# EAGLE design FilterSupplySingle (EAGLE 6.6.0)
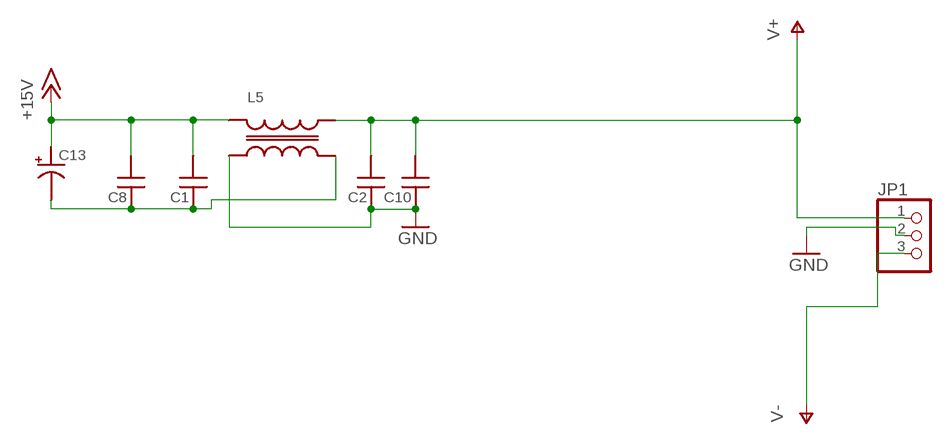
[diagram p0: schematic, sheet 1]

## Parts
C1  C_MLCC_SMDCMLCC_0805  [C_MLCC_0805]
C2  C_MLCC_SMDCMLCC_0805  [C_MLCC_0805]
C8  C_MLCC_SMDCMLCC_0603  [C_MLCC_0603]
C10  C_MLCC_SMDCMLCC_0603  [C_MLCC_0603]
C13  C_POL_SMDF  [PANASONIC_F]
JP1  PINHD-1X3  [1X03]
L5  MSD7342  [MSD7342]

## Nets
+15V: C1.P$2 C8.P$2 C13.+ L5.2
GND: C2.P$1 C10.P$1 JP1.2 L5.1
N$2: C1.P$1 C8.P$1 C13.- L5.3
V+: C2.P$2 C10.P$2 JP1.1 L5.4
V-: JP1.3

## Library data of the parts
C1 C2 C8 C10 = jqi_passives:C_MLCC_SMD
C13 = jqi_passives:C_POL_SMD
JP1 = pinhead:PINHD-1X3: PIN HEADER
L5 = coilcraft-jqi:MSD7342: MSD1260 series 1:1 coupled inductors

## Board
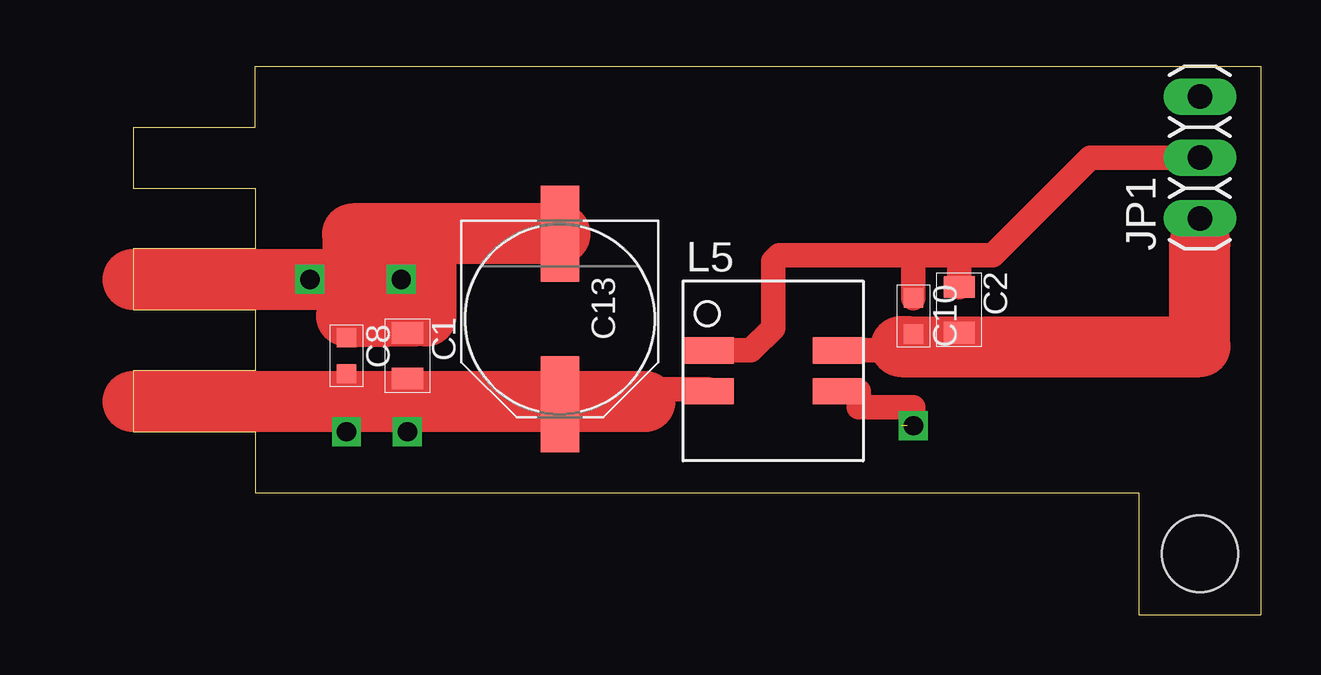
[diagram p1: board, top side]
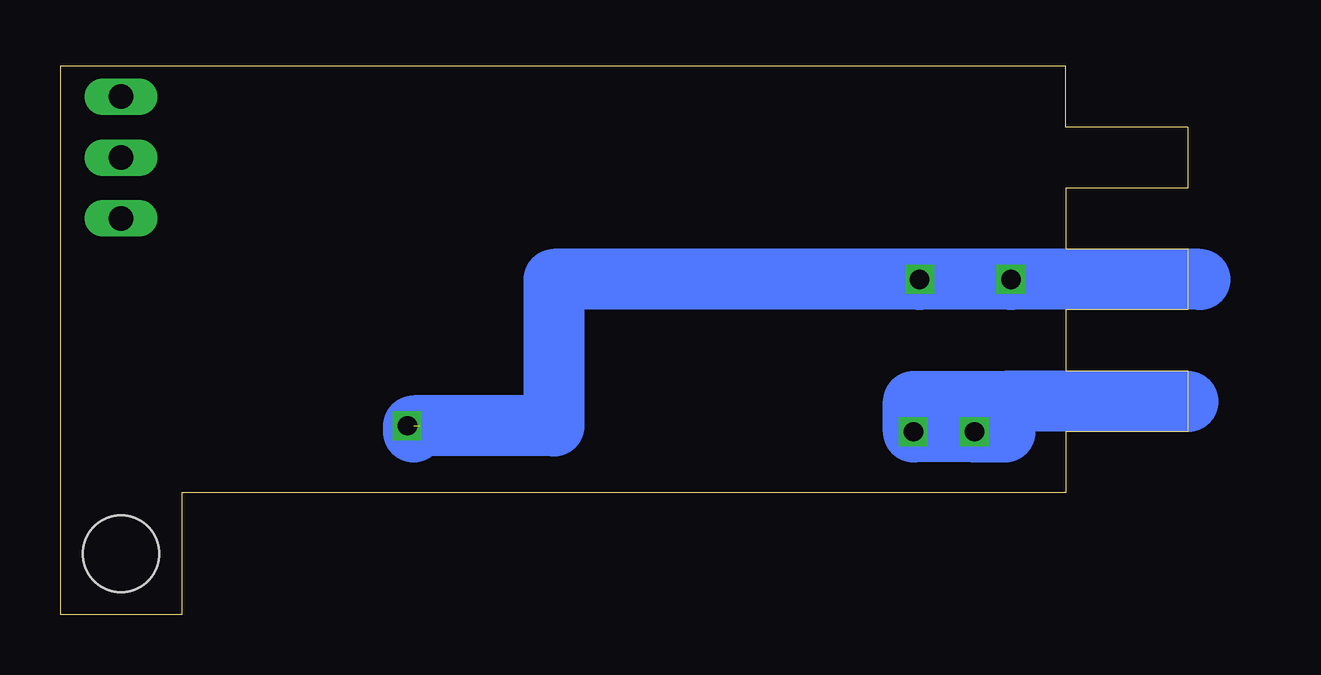
[diagram p2: board, bottom side, seen from below]

Size 46.99 x 22.86 mm. Coordinates in mm from the lower left corner, seen from the top.
Outline: 0,20.32 0,17.78 5.08,17.78 5.08,15.24 0,15.24 0,12.7 5.08,12.7 5.08,10.16 0,10.16 0,7.62 5.08,7.62 5.08,5.08 41.91,5.08 41.91,0 46.99,0 46.99,22.86 5.08,22.86 5.08,20.32 0,20.32
Copper layers (1*16): Top 0.035mm / dielectric 1.5mm / Bottom 0.035mm
Design rules "default *": minimum track width 10mil, minimum drill 0.6mm, track to track 8mil, track to pad 8mil, pad to pad 8mil, via to via 8mil, smd to smd 8mil, copper to edge 40mil, drill to drill 8mil, minimum pad ring 10mil, minimum via ring 8mil, stop-mask expansion 4mil, vias tented up to drill 0mil, thermal gap 10mil
Holes 3.17 mm at 44.45,2.54

### Footprints (pad centres in the part's own frame; a part is rotated, then mirrored left to right if it is on the bottom)
C_MLCC_0805 = smd 0.9 x 1.3: P$1 -0.95,0; P$2 0.95,0
C_MLCC_0603 = smd 0.8 x 0.8: P$1 -0.75,0; P$2 0.75,0
PANASONIC_F = smd 4 x 1.6: + 3.55,0; - -3.55,0
1X03 = drill 1.016 long: 1 -2.54,0; 2 0,0; 3 2.54,0
MSD7342 = smd 2.1 x 1.1: 1 -2.7,0.85; 2 -2.7,-0.85; 3 2.7,-0.85; 4 2.7,0.85

### Placement (x,y rotation side)
C1  11.43,10.79 270 top
C2  34.42,12.7 270 top
C8  8.89,10.79 270 top
C10  32.51,12.45 270 top
C13  17.78,12.32 270 top
JP1  44.45,19.05 90 top
L5  26.67,10.16 0 top

### Tracks (layer width: path | path; a pad name or v marks a point on that pad's centre or on a via)
+15V  (via drill 0.8)  (1 unrouted)
  Top 0.508: C8.P$2 v8.89,7.62 | C1.P$2 v11.43,7.62
  Top 1.016: L5.2 23.97,9.4 21.34,9.4 21.34,8.89 17.9,8.89 C13.+
  Top 2.54: 0,8.89 21.34,8.89
  Bottom 2.54: 7.62,8.89 11.43,8.89 v11.43,7.62 v8.89,7.62 | 0,8.89 7.62,8.89 | 7.62,8.89 v8.89,7.62 | v8.89,7.62 7.62,7.62
GND
  Top 1.016: L5.1 25.74,11.01 26.67,11.94 26.67,14.73 26.92,14.99 32.51,14.99 | 32.51,14.99 34.54,14.99 | 34.54,14.99 35.81,14.99 39.88,19.05 JP1.2 | C10.P$1 32.51,14.99 | C2.P$1 34.42,14.86 34.54,14.99
N$2  (via drill 0.8)  (1 unrouted)
  Top 0.508: C8.P$1 8.89,12.45 | C1.P$1 11.43,12.45
  Top 1.016: L5.3 30.23,9.31 30.23,8.64 32.51,8.64 v32.51,7.87
  Top 2.54: C13.- 9.14,15.87 9.14,13.97 8.89,13.97 | 0,13.97 v7.37,13.97 8.89,13.97 | 8.89,13.97 8.89,12.45 10.67,12.45 | 11.68,12.45 11.43,12.45 10.67,12.45 | 10.67,12.45 10.67,13.72 11.18,13.72 v11.18,13.97 11.18,15.24 12.19,15.24 12.19,12.45
  Bottom 1.016: v32.51,7.87 32,7.87 32,7.62
  Bottom 2.54: -0.51,13.97 v7.37,13.97 v11.18,13.97 26.42,13.97 26.42,7.87 32.26,7.87 32.26,7.62
V+
  Top 1.016: L5.4 31.5,11.01 32,11.18 | 44.45,15.49 JP1.1 | C2.P$2 32.83,11.75 32.51,11.43 | 32.51,11.43 32.26,11.18 | C10.P$2 32.51,11.43
  Top 2.54: 32,11.18 32.26,11.18 44.45,11.18 44.45,15.49